# Altium schematic sheet ZYNQ_PL_Bank_35.SchDoc
size A4; DocumentNumber: 7; SheetNumber: 7; SheetTotal: 47
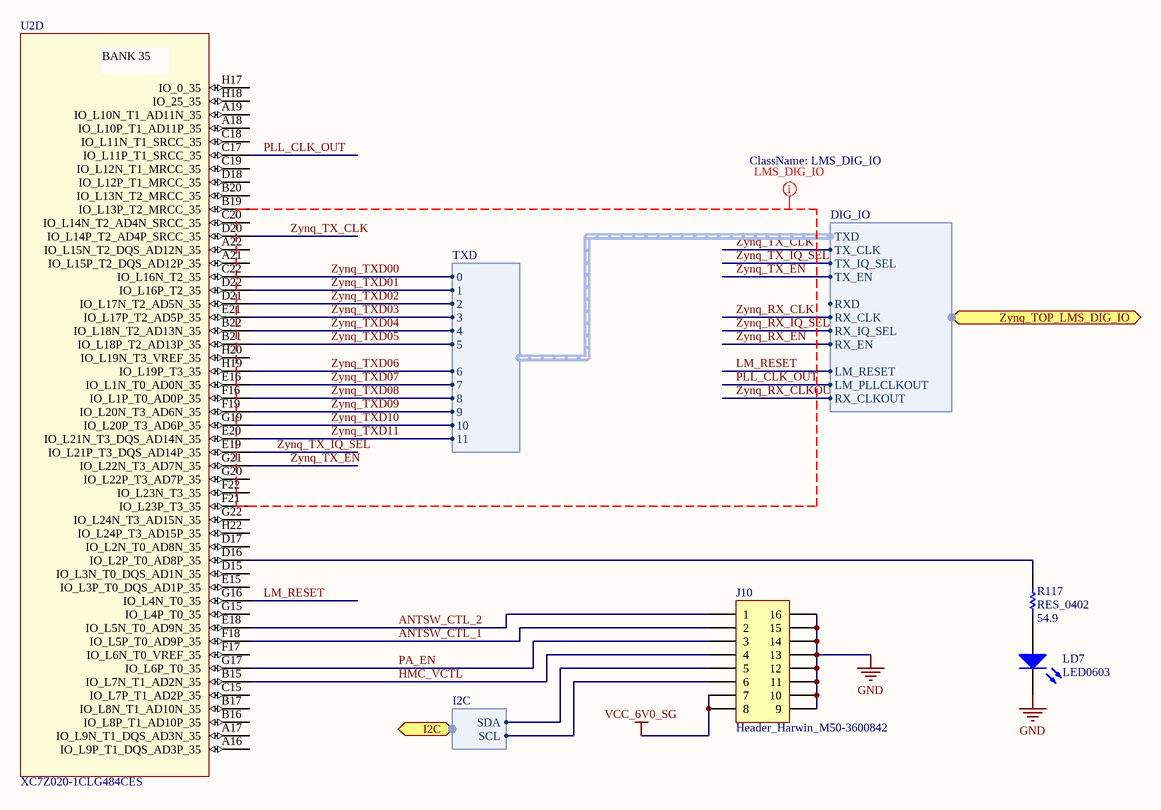
[diagram p0: ZYNQ_PL_Bank_35.SchDoc]

## Parts
J10  Header_Harwin_M50-3600842  [Header_Harwin_M50-3600842_16-pos]
LD7  LED0603  [LED0603(1608)_HSMG-C190]
R117  RES_0402  value 54.9  [RESC0402(1005)_N]
U2  XC7Z020-1CLG484CES  [ZYNQ_xc7z020clg484pkg_BGA-484]  (part D of 10)

## Ports
I2C (harness I2C), Zynq_TOP_LMS_DIG_IO (harness DIG_IO)

## Harnesses
TXD: 0, 1, 2, 3, 4, 5, 6, 7, 8, 9, 10, 11
DIG_IO: TXD, TX_CLK, TX_IQ_SEL, TX_EN, RXD, RX_CLK, RX_IQ_SEL, RX_EN, LM_RESET, LM_PLLCLKOUT, RX_CLKOUT
I2C: SCL, SDA

## Nets
GND: J10.9 J10.10 J10.11 J10.12 J10.13 J10.14 J10.15 J10.16 LD7.1(K)
VCC_6V0_SG: J10.7 J10.8
ANTSW_CTL_1: J10.2 U2.F18(IO_L5P_T0_AD9P_35)
ANTSW_CTL_2: J10.1 U2.E18(IO_L5N_T0_AD9N_35)
HMC_VCTL: J10.4 U2.B15(IO_L7N_T1_AD2N_35)
LM_RESET: U2.G16(IO_L4N_T0_35) ; port Zynq_TOP_LMS_DIG_IO.LM_RESET
PA_EN: J10.3 U2.G17(IO_L6P_T0_35)
PLL_CLK_OUT: U2.C17(IO_L11P_T1_SRCC_35) ; port Zynq_TOP_LMS_DIG_IO.LM_PLLCLKOUT
Zynq_RX_CLK: port Zynq_TOP_LMS_DIG_IO.RX_CLK
Zynq_RX_CLKOUT: port Zynq_TOP_LMS_DIG_IO.RX_CLKOUT
Zynq_RX_EN: port Zynq_TOP_LMS_DIG_IO.RX_EN
Zynq_RX_IQ_SEL: port Zynq_TOP_LMS_DIG_IO.RX_IQ_SEL
Zynq_TX_CLK: U2.D20(IO_L14P_T2_AD4P_SRCC_35) ; port Zynq_TOP_LMS_DIG_IO.TX_CLK
Zynq_TX_EN: U2.G21(IO_L22N_T3_AD7N_35) ; port Zynq_TOP_LMS_DIG_IO.TX_EN
Zynq_TX_IQ_SEL: U2.E19(IO_L21P_T3_DQS_AD14P_35) ; port Zynq_TOP_LMS_DIG_IO.TX_IQ_SEL
Zynq_TXD00: U2.C22(IO_L16N_T2_35) ; harness TXD.0
Zynq_TXD01: U2.D22(IO_L16P_T2_35) ; harness TXD.1
Zynq_TXD02: U2.D21(IO_L17N_T2_AD5N_35) ; harness TXD.2
Zynq_TXD03: U2.E21(IO_L17P_T2_AD5P_35) ; harness TXD.3
Zynq_TXD04: U2.B22(IO_L18N_T2_AD13N_35) ; harness TXD.4
Zynq_TXD05: U2.B21(IO_L18P_T2_AD13P_35) ; harness TXD.5
Zynq_TXD06: U2.H19(IO_L19P_T3_35) ; harness TXD.6
Zynq_TXD07: U2.E16(IO_L1N_T0_AD0N_35) ; harness TXD.7
Zynq_TXD08: U2.F16(IO_L1P_T0_AD0P_35) ; harness TXD.8
Zynq_TXD09: U2.F19(IO_L20N_T3_AD6N_35) ; harness TXD.9
Zynq_TXD10: U2.G19(IO_L20P_T3_AD6P_35) ; harness TXD.10
Zynq_TXD11: U2.E20(IO_L21N_T3_DQS_AD14N_35) ; harness TXD.11
NetJ10_5: J10.5 ; port I2C.SDA
NetJ10_6: J10.6 ; port I2C.SCL
NetLD7_2: LD7.2(A) R117.1
NetR117_2: R117.2 U2.D16(IO_L2P_T0_AD8P_35)

Not connected (* = marked no-connect by the designer): U2 A16(IO_L9P_T1_DQS_AD3P_35) A17(IO_L9N_T1_DQS_AD3N_35) A18(IO_L10P_T1_AD11P_35) A19(IO_L10N_T1_AD11N_35) A21(IO_L15P_T2_DQS_AD12P_35) A22(IO_L15N_T2_DQS_AD12N_35) B16(IO_L8P_T1_AD10P_35) B17(IO_L8N_T1_AD10N_35) B19(IO_L13P_T2_MRCC_35) B20(IO_L13N_T2_MRCC_35) C15(IO_L7P_T1_AD2P_35) C18(IO_L11N_T1_SRCC_35) C19(IO_L12N_T1_MRCC_35) C20(IO_L14N_T2_AD4N_SRCC_35) D15(IO_L3N_T0_DQS_AD1N_35) D17(IO_L2N_T0_AD8N_35) D18(IO_L12P_T1_MRCC_35) E15(IO_L3P_T0_DQS_AD1P_35) F17(IO_L6N_T0_VREF_35) F21(IO_L23P_T3_35) F22(IO_L23N_T3_35) G15(IO_L4P_T0_35) G20(IO_L22P_T3_AD7P_35) G22(IO_L24N_T3_AD15N_35) H17(IO_0_35) H18(IO_25_35) H20(IO_L19N_T3_VREF_35) H22(IO_L24P_T3_AD15P_35)

## Layout directives
net class LMS_DIG_IO: LM_RESET, PLL_CLK_OUT, Zynq_RX_CLK, Zynq_RX_CLKOUT, Zynq_RX_EN, Zynq_RX_IQ_SEL, Zynq_TX_CLK, Zynq_TX_EN, Zynq_TX_IQ_SEL, Zynq_TXD00, Zynq_TXD01, Zynq_TXD02, Zynq_TXD03, Zynq_TXD04, Zynq_TXD05, Zynq_TXD06, Zynq_TXD07, Zynq_TXD08, Zynq_TXD09, Zynq_TXD10, Zynq_TXD11

## Notes on the sheet
- (in symbol XC7Z020-1CLG484CES, part D) BANK 35

## Library data of the parts
J10 = M50-3600842: CONN HDR 1.27MM SMD AU 16POS; Manufacturer: Harwin Inc; Part Number: M50-3600842
LD7 = "HSMG-C190": LED 570NM GREEN DIFF 0603 SMD; Manufacturer: Avago; Value: "HSMG-C190 green"; Part Number: "HSMG-C190"; Footprint Ref: LED0603(1608); Library Ref: LED0603
R117 = ERJ-2RKF54R9X: RES 54.9 OHM 1/10W 1% 0402 SMD; Manufacturer: Panasonic Electronic Components; Tolerance: *; Part Number: ERJ-2RKF54R9X; Footprint Ref: RESC0402(1005)_N; Library Ref: RES_0402
U2 = XC7Z020-1CLG484CES: XC7Z020-1CLG484CES, Zynq-7000 All Programmable SoC; Manufacturer: Xilinx; Part Number: XC7Z020-1CLG484CES